# Altium schematic sheet array.SchDoc: CS - Array
size Letter; CheckedBy: J. Brinton; CompanyName: Signal Laboratories, Inc.; DrawnBy: J. Brinton; Engineer: J. Brinton; Address1: 3479 Edison Way; Address2: Menlo Park CA 94025; Address3: +1 (877) 778-8435; Address4: siglabs.com; Revision: 3; SheetNumber: 3; SheetTotal: 47
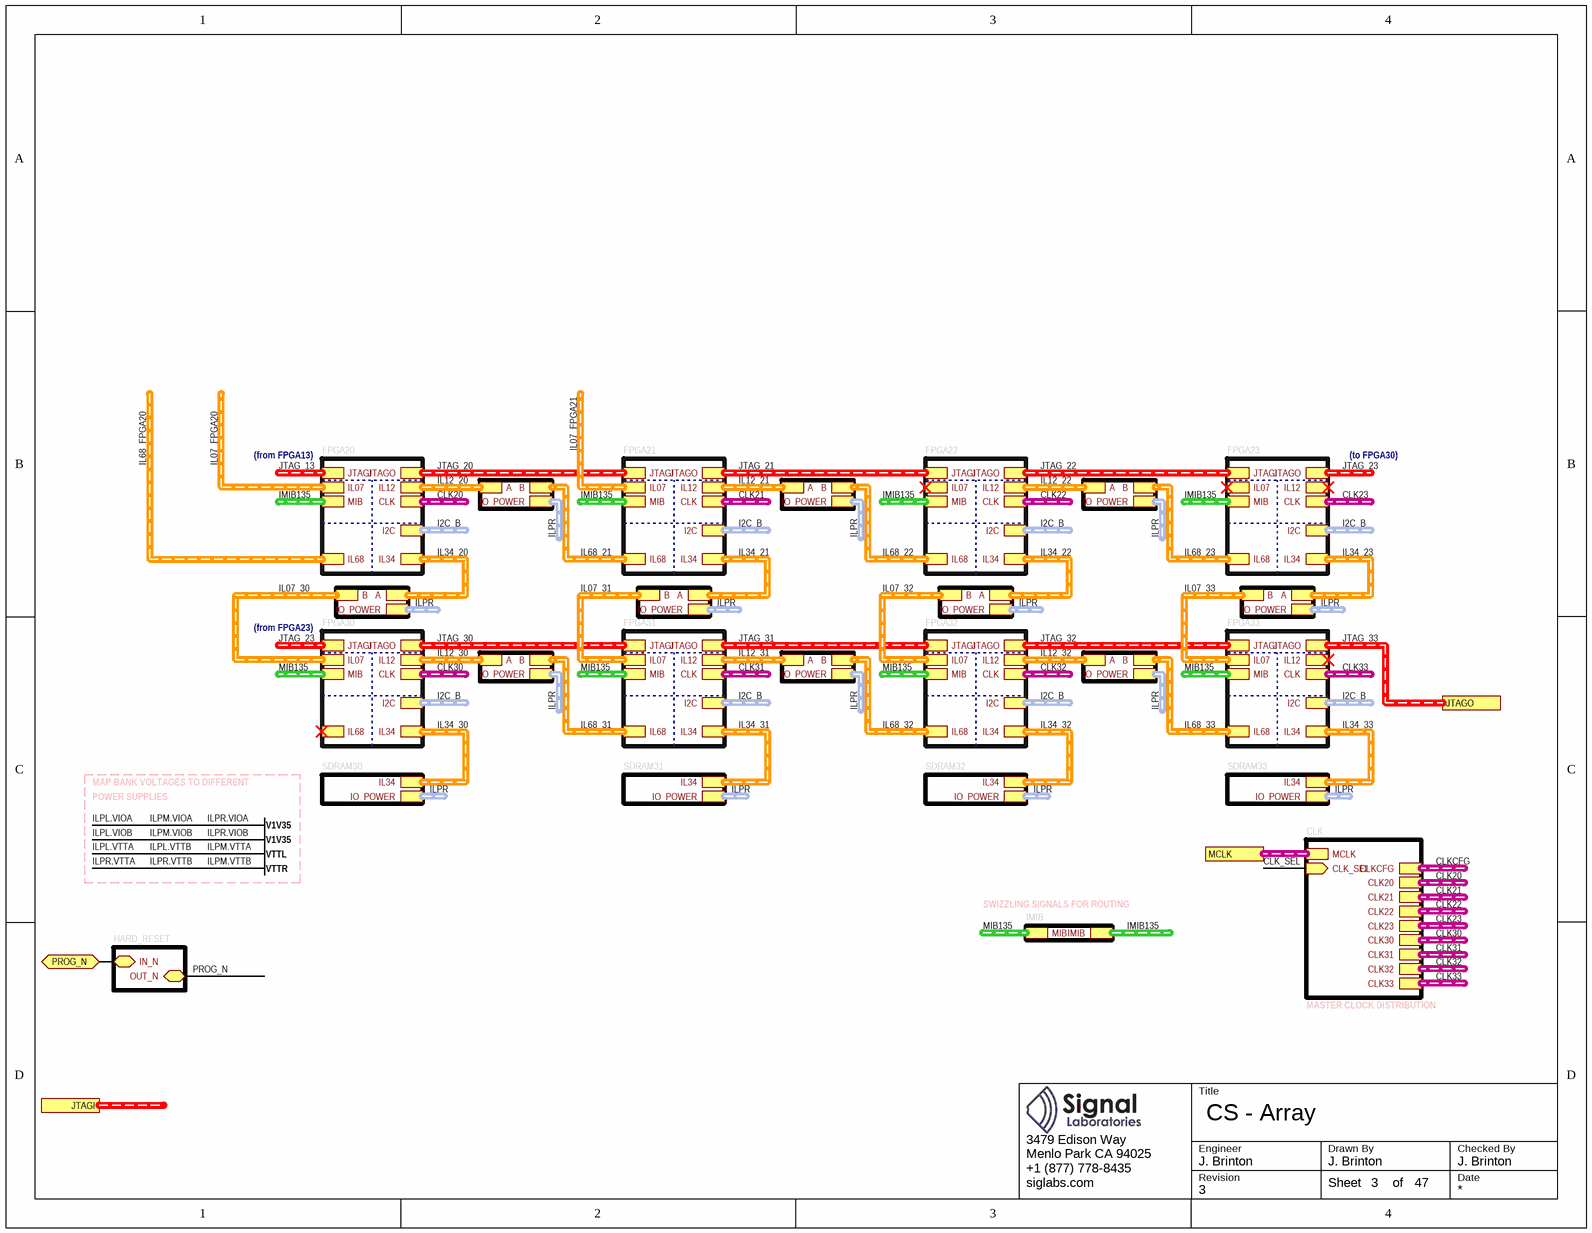
[diagram p0: array.SchDoc]

## Sub-sheets
CLK = clock.SchDoc: MCLK (harness LVPECL33), CLK20 (harness LVPECL33), CLK21 (harness LVPECL33), CLK22 (harness LVPECL33), CLK23 (harness LVPECL33), CLK30 (harness LVPECL33), CLK31 (harness LVPECL33), CLK32 (harness LVPECL33), CLK33 (harness LVPECL33), CLKCFG (harness LVPECL33), CLK_SEL (in)
FPGA20 = fpga.SchDoc: MIB (harness MIB), JTAGI (harness JTAG-3V3), JTAGO (harness JTAG-3V3), IL07 (harness IL), IL68 (harness IL), IL12 (harness IL), CLK (harness LVPECL33), IL34 (harness IL), I2C (harness I2C-3V3)
FPGA21 = fpga.SchDoc: MIB (harness MIB), JTAGI (harness JTAG-3V3), JTAGO (harness JTAG-3V3), IL07 (harness IL), IL68 (harness IL), IL12 (harness IL), CLK (harness LVPECL33), IL34 (harness IL), I2C (harness I2C-3V3)
FPGA22 = fpga.SchDoc: MIB (harness MIB), JTAGI (harness JTAG-3V3), JTAGO (harness JTAG-3V3), IL07 (harness IL), IL68 (harness IL), IL12 (harness IL), CLK (harness LVPECL33), IL34 (harness IL), I2C (harness I2C-3V3)
FPGA23 = fpga.SchDoc: MIB (harness MIB), JTAGI (harness JTAG-3V3), JTAGO (harness JTAG-3V3), IL07 (harness IL), IL68 (harness IL), IL12 (harness IL), CLK (harness LVPECL33), IL34 (harness IL), I2C (harness I2C-3V3)
FPGA30 = fpga.SchDoc: MIB (harness MIB), JTAGI (harness JTAG-3V3), JTAGO (harness JTAG-3V3), IL07 (harness IL), IL68 (harness IL), IL12 (harness IL), CLK (harness LVPECL33), IL34 (harness IL), I2C (harness I2C-3V3)
FPGA31 = fpga.SchDoc: MIB (harness MIB), JTAGI (harness JTAG-3V3), JTAGO (harness JTAG-3V3), IL07 (harness IL), IL68 (harness IL), IL12 (harness IL), CLK (harness LVPECL33), IL34 (harness IL), I2C (harness I2C-3V3)
FPGA32 = fpga.SchDoc: MIB (harness MIB), JTAGI (harness JTAG-3V3), JTAGO (harness JTAG-3V3), IL07 (harness IL), IL68 (harness IL), IL12 (harness IL), CLK (harness LVPECL33), IL34 (harness IL), I2C (harness I2C-3V3)
FPGA33 = fpga.SchDoc: MIB (harness MIB), JTAGI (harness JTAG-3V3), JTAGO (harness JTAG-3V3), IL07 (harness IL), IL68 (harness IL), IL12 (harness IL), CLK (harness LVPECL33), IL34 (harness IL), I2C (harness I2C-3V3)
HARD_RESET = reset.SchDoc: OUT_N (bidir), IN_N (bidir)
IMIB = tie-mib-imib.SchDoc: MIB (harness MIB), IMIB (harness MIB)
SDRAM30 = tie-il34-sdram.SchDoc: IL34 (harness IL), IO_POWER (harness ILP)
SDRAM31 = tie-il34-sdram.SchDoc: IL34 (harness IL), IO_POWER (harness ILP)
SDRAM32 = tie-il34-sdram.SchDoc: IL34 (harness IL), IO_POWER (harness ILP)
SDRAM33 = tie-il34-sdram.SchDoc: IL34 (harness IL), IO_POWER (harness ILP)
TIE-IL12_20-IL68_21 = tie-il12-il68.SchDoc: A (harness IL), B (harness IL), IO_POWER (harness ILP)
TIE-IL12_21-IL68_22 = tie-il12-il68.SchDoc: A (harness IL), B (harness IL), IO_POWER (harness ILP)
TIE-IL12_22-IL68_23 = tie-il12-il68.SchDoc: A (harness IL), B (harness IL), IO_POWER (harness ILP)
TIE-IL12_30-IL68_31 = tie-il12-il68.SchDoc: A (harness IL), B (harness IL), IO_POWER (harness ILP)
TIE-IL12_31-IL68_32 = tie-il12-il68.SchDoc: A (harness IL), B (harness IL), IO_POWER (harness ILP)
TIE-IL12_32-IL68_33 = tie-il12-il68.SchDoc: A (harness IL), B (harness IL), IO_POWER (harness ILP)
TIE-IL34_20-IL07_30 = tie-il34-il07.SchDoc: B (harness IL), A (harness IL), IO_POWER (harness ILP)
TIE-IL34_21-IL07_31 = tie-il34-il07.SchDoc: B (harness IL), A (harness IL), IO_POWER (harness ILP)
TIE-IL34_22-IL07_32 = tie-il34-il07.SchDoc: B (harness IL), A (harness IL), IO_POWER (harness ILP)
TIE-IL34_23-IL07_33 = tie-il34-il07.SchDoc: B (harness IL), A (harness IL), IO_POWER (harness ILP)

## Ports
JTAGI (harness JTAG-3V3), JTAGO (harness JTAG-3V3), MCLK (harness LVPECL33), PROG_N (bidir)

## Nets
CLK_SEL: sheet CLK/CLK_SEL
PROG_N: sheet HARD_RESET/OUT_N
PROG_N: port PROG_N, sheet HARD_RESET/IN_N  [a separate net that carries the same name]

## Buses and harness runs
harness CLK20 = sheet CLK/CLK20
harness CLK20 = sheet FPGA20/CLK
harness CLK21 = sheet CLK/CLK21
harness CLK21 = sheet FPGA21/CLK
harness CLK22 = sheet CLK/CLK22
harness CLK22 = sheet FPGA22/CLK
harness CLK23 = sheet CLK/CLK23
harness CLK23 = sheet FPGA23/CLK
harness CLK30 = sheet CLK/CLK30
harness CLK30 = sheet FPGA30/CLK
harness CLK31 = sheet CLK/CLK31
harness CLK31 = sheet FPGA31/CLK
harness CLK32 = sheet CLK/CLK32
harness CLK32 = sheet FPGA32/CLK
harness CLK33 = sheet CLK/CLK33
harness CLK33 = sheet FPGA33/CLK
harness CLKCFG = sheet CLK/CLKCFG
harness I2C_B = sheet FPGA20/I2C
harness I2C_B = sheet FPGA21/I2C
harness I2C_B = sheet FPGA22/I2C
harness I2C_B = sheet FPGA23/I2C
harness I2C_B = sheet FPGA30/I2C
harness I2C_B = sheet FPGA31/I2C
harness I2C_B = sheet FPGA32/I2C
harness I2C_B = sheet FPGA33/I2C
harness IL07_30 = sheet FPGA30/IL07 = sheet TIE-IL34_20-IL07_30/B
harness IL07_31 = sheet FPGA31/IL07 = sheet TIE-IL34_21-IL07_31/B
harness IL07_32 = sheet FPGA32/IL07 = sheet TIE-IL34_22-IL07_32/B
harness IL07_33 = sheet FPGA33/IL07 = sheet TIE-IL34_23-IL07_33/B
harness IL07_FPGA20 = sheet FPGA20/IL07
harness IL07_FPGA21 = sheet FPGA21/IL07
harness IL12_20 = sheet FPGA20/IL12 = sheet TIE-IL12_20-IL68_21/A
harness IL12_21 = sheet FPGA21/IL12 = sheet TIE-IL12_21-IL68_22/A
harness IL12_22 = sheet FPGA22/IL12 = sheet TIE-IL12_22-IL68_23/A
harness IL12_30 = sheet FPGA30/IL12 = sheet TIE-IL12_30-IL68_31/A
harness IL12_31 = sheet FPGA31/IL12 = sheet TIE-IL12_31-IL68_32/A
harness IL12_32 = sheet FPGA32/IL12 = sheet TIE-IL12_32-IL68_33/A
harness IL34_20 = sheet FPGA20/IL34 = sheet TIE-IL34_20-IL07_30/A
harness IL34_21 = sheet FPGA21/IL34 = sheet TIE-IL34_21-IL07_31/A
harness IL34_22 = sheet FPGA22/IL34 = sheet TIE-IL34_22-IL07_32/A
harness IL34_23 = sheet FPGA23/IL34 = sheet TIE-IL34_23-IL07_33/A
harness IL34_30 = sheet FPGA30/IL34 = sheet SDRAM30/IL34
harness IL34_31 = sheet FPGA31/IL34 = sheet SDRAM31/IL34
harness IL34_32 = sheet FPGA32/IL34 = sheet SDRAM32/IL34
harness IL34_33 = sheet FPGA33/IL34 = sheet SDRAM33/IL34
harness IL68_21 = sheet FPGA21/IL68 = sheet TIE-IL12_20-IL68_21/B
harness IL68_22 = sheet FPGA22/IL68 = sheet TIE-IL12_21-IL68_22/B
harness IL68_23 = sheet FPGA23/IL68 = sheet TIE-IL12_22-IL68_23/B
harness IL68_31 = sheet FPGA31/IL68 = sheet TIE-IL12_30-IL68_31/B
harness IL68_32 = sheet FPGA32/IL68 = sheet TIE-IL12_31-IL68_32/B
harness IL68_33 = sheet FPGA33/IL68 = sheet TIE-IL12_32-IL68_33/B
harness IL68_FPGA20 = sheet FPGA20/IL68
harness ILPR = sheet SDRAM30/IO_POWER
harness ILPR = sheet SDRAM31/IO_POWER
harness ILPR = sheet SDRAM32/IO_POWER
harness ILPR = sheet SDRAM33/IO_POWER
harness ILPR = sheet TIE-IL12_20-IL68_21/IO_POWER
harness ILPR = sheet TIE-IL12_21-IL68_22/IO_POWER
harness ILPR = sheet TIE-IL12_22-IL68_23/IO_POWER
harness ILPR = sheet TIE-IL12_30-IL68_31/IO_POWER
harness ILPR = sheet TIE-IL12_31-IL68_32/IO_POWER
harness ILPR = sheet TIE-IL12_32-IL68_33/IO_POWER
harness ILPR = sheet TIE-IL34_20-IL07_30/IO_POWER
harness ILPR = sheet TIE-IL34_21-IL07_31/IO_POWER
harness ILPR = sheet TIE-IL34_22-IL07_32/IO_POWER
harness ILPR = sheet TIE-IL34_23-IL07_33/IO_POWER
harness IMIB135 = sheet FPGA20/MIB
harness IMIB135 = sheet FPGA21/MIB
harness IMIB135 = sheet FPGA22/MIB
harness IMIB135 = sheet FPGA23/MIB
harness IMIB135 = sheet IMIB/IMIB
harness JTAG_13 = sheet FPGA20/JTAGI
harness JTAG_20 = sheet FPGA20/JTAGO = sheet FPGA21/JTAGI
harness JTAG_21 = sheet FPGA21/JTAGO = sheet FPGA22/JTAGI
harness JTAG_22 = sheet FPGA22/JTAGO = sheet FPGA23/JTAGI
harness JTAG_23 = sheet FPGA23/JTAGO
harness JTAG_23 = sheet FPGA30/JTAGI
harness JTAG_30 = sheet FPGA30/JTAGO = sheet FPGA31/JTAGI
harness JTAG_31 = sheet FPGA31/JTAGO = sheet FPGA32/JTAGI
harness JTAG_32 = sheet FPGA32/JTAGO = sheet FPGA33/JTAGI
harness JTAG_33 = port JTAGO = sheet FPGA33/JTAGO
harness MIB135 = sheet FPGA30/MIB
harness MIB135 = sheet FPGA31/MIB
harness MIB135 = sheet FPGA32/MIB
harness MIB135 = sheet FPGA33/MIB
harness MIB135 = sheet IMIB/MIB
harness port MCLK = sheet CLK/MCLK

## Notes on the sheet
- (from FPGA13)
- (to FPGA30)
- (from FPGA23)
- POWER SUPPLIES
- MAP BANK VOLTAGES TO DIFFERENT
- SWIZZLING SIGNALS FOR ROUTING
- MASTER CLOCK DISTRIBUTION
- Title
- Engineer
- Revision
- Drawn By
- Checked By
- Date
- Sheet
- of